# Altium project AtlysAFE.PrjPCB (part 2 of 2)
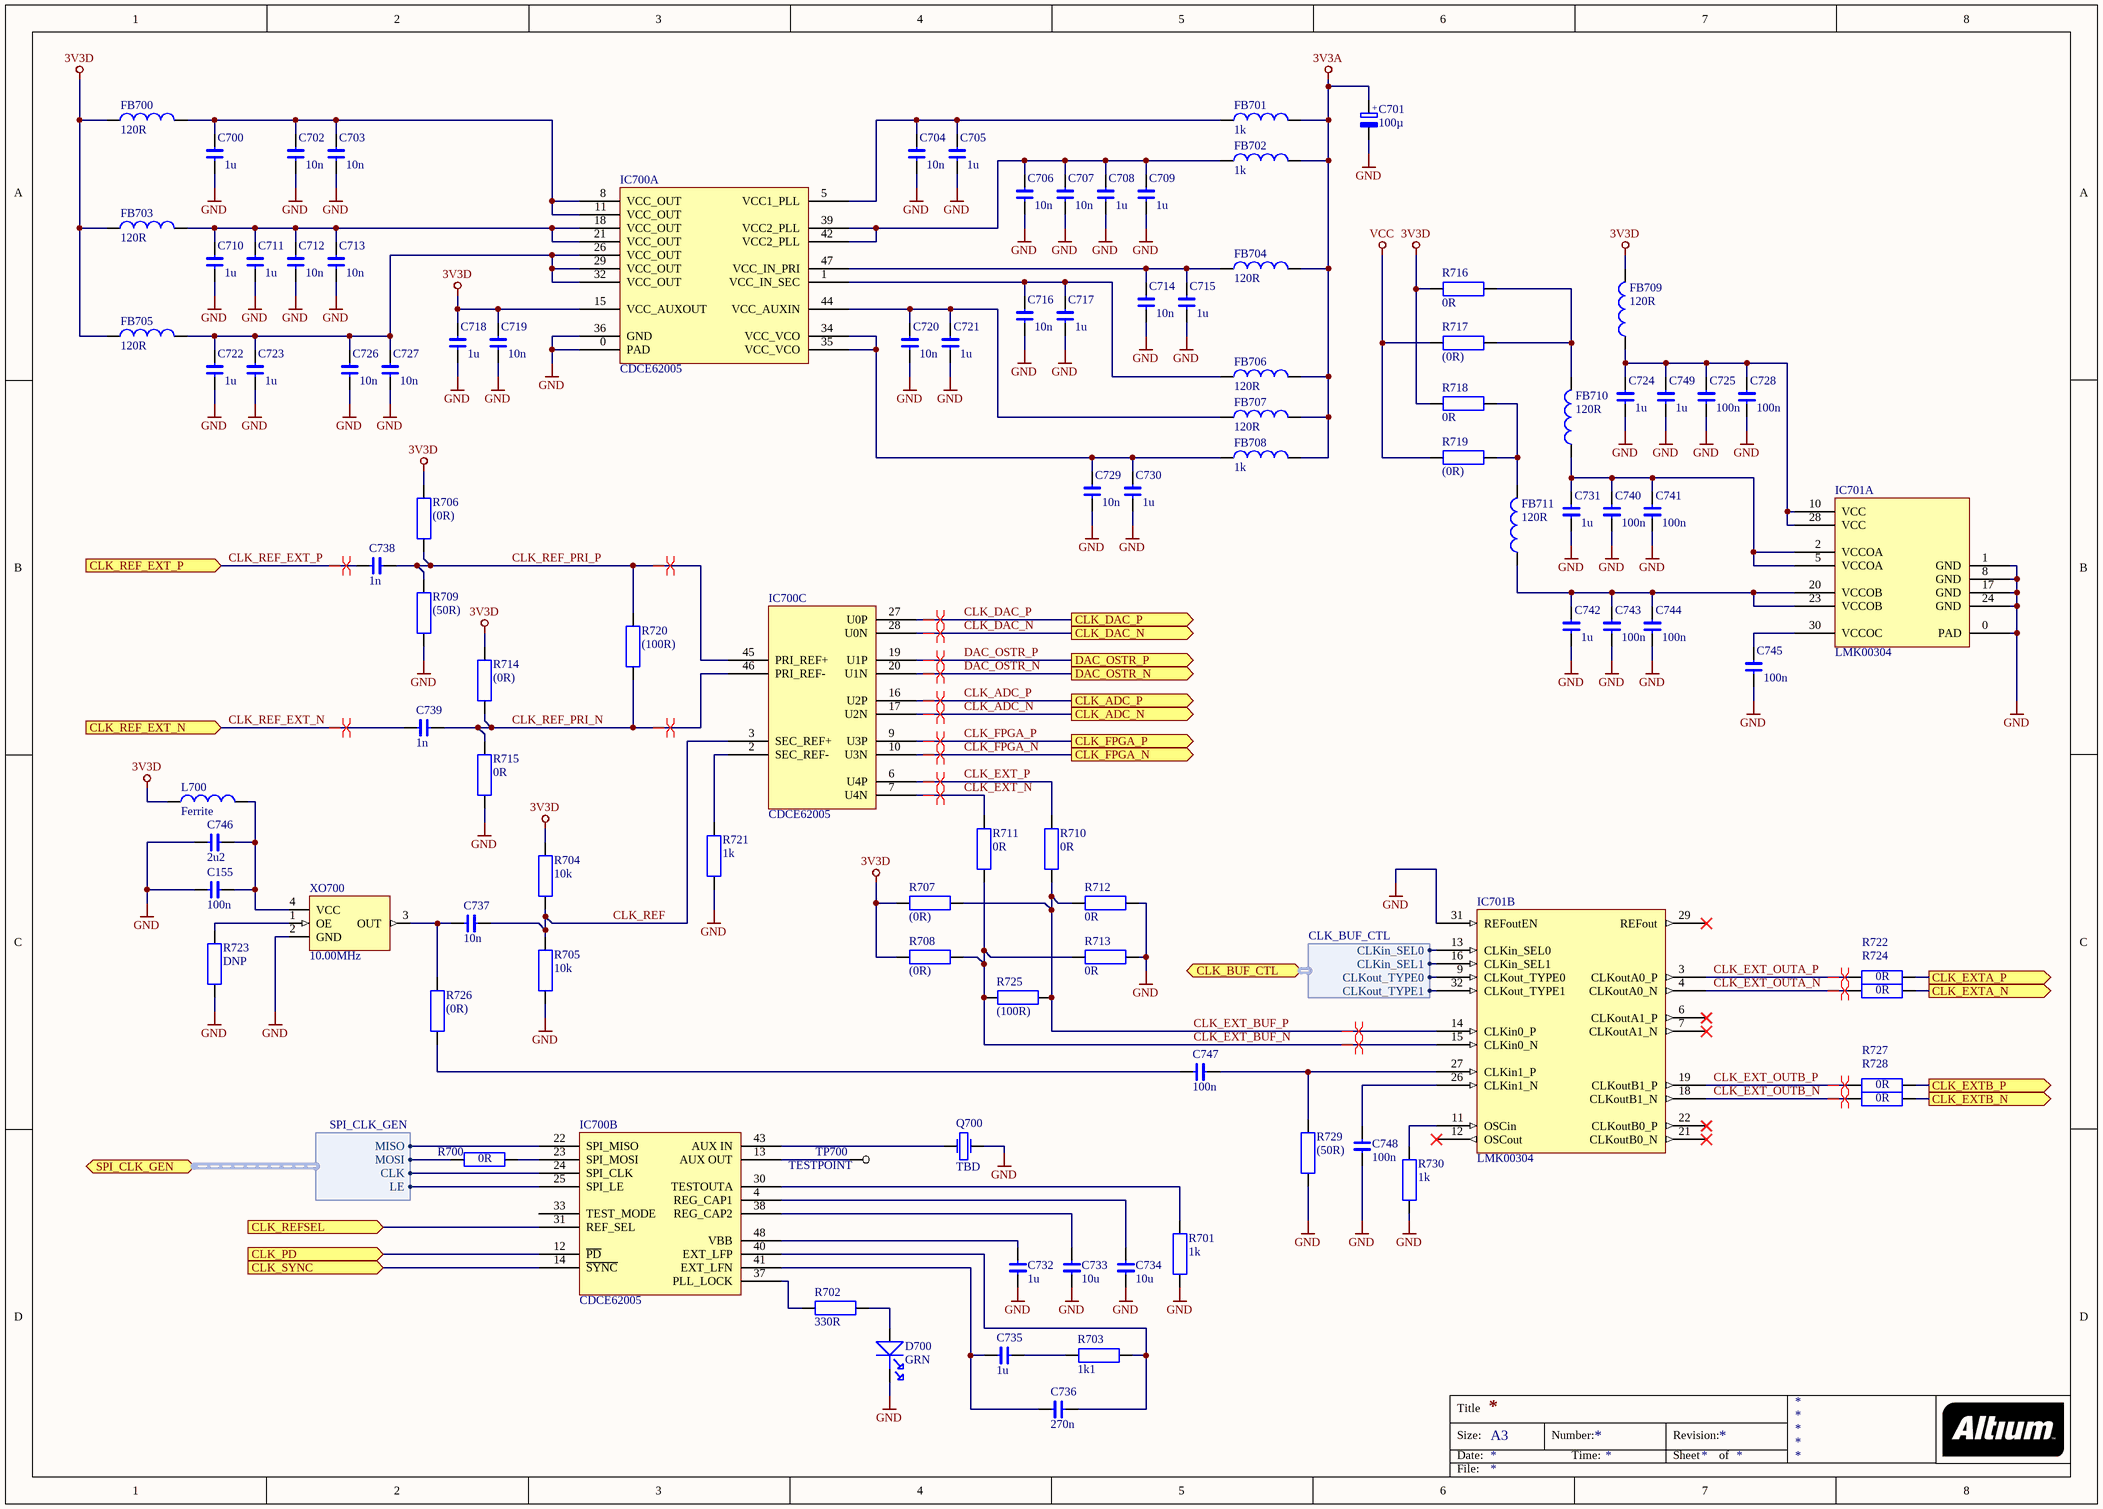
[diagram p8: Clock.SchDoc]

## Nets that join several sheets
1V8D: DAC (10 pins), FPGA (C410.1 IC400.11), Power (C519.1 L507.2), USB (7 pins)
3V3A: ADC (6 pins), ADC_Input (16 pins), DAC (9 pins), Power (5 pins), Clock (7 pins)
3V3D: Main (P3.15), ADC (15 pins), FPGA (16 pins), Power (C510.1 L503.2), USB (20 pins), Clock (15 pins)
DAC_BIAS: DAC (8 pins), Power (5 pins)
EXT_SUPPLY: Main (C4.1 P4.2), Power (13 pins)
GND: Main (44 pins), ADC (34 pins), ADC_Input (28 pins), DAC (27 pins), FPGA (23 pins), Power (47 pins), USB (30 pins), Clock (66 pins)
VCC: Main (5 pins), FPGA (C402.1 C403.1 IC400.80 IC400.93), Clock (R717.2 R719.2)
CLK_ADC_N: ADC (C119.1 R123.2 R125.1), Clock (IC700.17)
CLK_ADC_P: ADC (C118.1 R122.2 R124.1), Clock (IC700.16)
CLK_DAC_N: DAC (C312.1 R305.1), Clock (IC700.28)
CLK_DAC_P: DAC (C311.1 R304.1), Clock (IC700.27)
CLK_EXTA_N: Main (X8.2), Clock (R724.2)
CLK_EXTA_P: Main (X5.2), Clock (R722.2)
CLK_EXTB_N: Main (X14.2), Clock (R728.2)
CLK_EXTB_P: Main (X13.2), Clock (R727.2)
CLK_FPGA_N: FPGA (IC400.85), Clock (IC700.10)
CLK_FPGA_P: FPGA (IC400.86), Clock (IC700.9)
CLK_REF_EXT_N: Main (X6.2), Clock (C739.1)
CLK_REF_EXT_P: Main (X3.2), Clock (C738.1)
DAC_OSTR_N: DAC (C314.1 R308.1), Clock (IC700.20)
DAC_OSTR_P: DAC (C313.1 R307.1), Clock (IC700.19)
DACA_BIAS_N: Main (X10.2), DAC (R314.2 R315.1)
DACA_BIAS_P: Main (X9.2), DAC (R311.2 R312.1)
DACB_BIAS_N: Main (X12.2), DAC (R320.2 R321.1)
DACB_BIAS_P: Main (X11.2), DAC (R317.2 R318.1)
FPGA_PGOOD: FPGA (IC400.74), Power (IC501.12 IC501.29 R504.2 R505.1)
IO1_N: Main (P1.35), ADC (IC100.38)
IO1_P: Main (P1.1), ADC (IC100.37)
IO2_N: Main (P1.37), ADC (IC100.40)
IO2_P: Main (P1.3), ADC (IC100.39)
IO3_N: Main (P1.38), ADC (IC100.42)
IO3_P: Main (P1.4), ADC (IC100.41)
IO4_N: Main (P1.40), FPGA (IC400.87)
IO4_P: Main (P1.6), FPGA (IC400.88)
IO5_N: Main (P1.41), ADC (IC100.46)
IO5_P: Main (P1.7), ADC (IC100.45)
IO6_N: Main (P1.43), ADC (IC100.48)
IO6_P: Main (P1.9), ADC (IC100.47)
IO7_N: Main (P1.44), FPGA (IC400.35 R400.1)
IO7_P: Main (P1.10), FPGA (IC400.34 R400.2)
IO8_N: Main (P1.46), FPGA (IC400.37 R401.1 R408.2)
IO8_P: Main (P1.12), FPGA (IC400.36 R401.2 R407.2)
IO9_N: Main (P1.47), FPGA (IC400.39 R402.1)
IO9_P: Main (P1.13), FPGA (IC400.38 R402.2)
IO10_N: Main (P1.49), ADC (IC100.44)
IO10_P: Main (P1.15), ADC (IC100.43)
IO11_N: Main (P1.54), DAC (IC300.10)
IO11_P: Main (P1.20), DAC (IC300.9)
IO12_N: Main (P1.56), DAC (IC300.12)
IO12_P: Main (P1.22), DAC (IC300.11)
IO13_N: Main (P1.57), DAC (IC300.14)
IO13_P: Main (P1.23), DAC (IC300.13)
IO14_N: Main (P1.59), DAC (IC300.16)
IO14_P: Main (P1.25), DAC (IC300.15)
IO15_N: Main (P1.60), DAC (IC300.18)
IO15_P: Main (P1.26), DAC (IC300.17)
IO16_N: Main (P1.62), DAC (IC300.20)
IO16_P: Main (P1.28), DAC (IC300.19)
IO17_N: Main (P1.63), DAC (IC300.22)
IO17_P: Main (P1.29), DAC (IC300.21)
IO18_N: Main (P1.65), DAC (IC300.24)
IO18_P: Main (P1.31), DAC (IC300.23)
IO19_N: Main (P1.66), DAC (IC300.26)
IO19_P: Main (P1.32), DAC (IC300.25)
IO20_N: Main (P1.68), DAC (IC300.28)
IO20_P: Main (P1.34), DAC (IC300.27)
JTAG_TCK: FPGA (IC400.91), USB (R600.2)
JTAG_TDI: FPGA (IC400.94), USB (R601.2)
JTAG_TDO: FPGA (IC400.95), USB (R602.2)
JTAG_TMS: FPGA (IC400.90), USB (R603.2)
NetC106_1: ADC (9 pins), ADC_Input (R201.1 R216.1)
NetIC100_4: ADC (IC100.4), FPGA (IC400.25)
NetIC100_30: ADC (IC100.30 R109.2), FPGA (IC400.24)
NetIC100_31: ADC (IC100.31 R108.2), FPGA (IC400.21)
NetIC100_32: ADC (IC100.32), FPGA (IC400.18)
NetIC100_34: ADC (IC100.34), FPGA (IC400.20)
NetIC200_3: ADC (R110.2), ADC_Input (IC200.3 R214.1)
NetIC200_10: ADC (R111.2), ADC_Input (IC200.10 R200.1)
NetIC200_12: ADC_Input (IC200.12 R212.2), FPGA (IC400.27)
NetIC201_3: ADC (R118.2), ADC_Input (IC201.3 R229.1)
NetIC201_10: ADC (R120.2), ADC_Input (IC201.10 R215.1)
NetIC201_12: ADC_Input (IC201.12 R227.2), FPGA (IC400.28)
NetIC300_30: DAC (IC300.30 R309.1), FPGA (IC400.14)
NetIC300_32: DAC (IC300.32), FPGA (IC400.12)
NetIC300_33: DAC (IC300.33), FPGA (IC400.16)
NetIC400_1: FPGA (IC400.1), USB (IC600.45)
NetIC400_2: FPGA (IC400.2), USB (IC600.44)
NetIC400_3: FPGA (IC400.3), USB (IC600.43)
NetIC400_4: FPGA (IC400.4), USB (IC600.41)
NetIC400_7: FPGA (IC400.7), USB (IC600.40)
NetIC400_8: FPGA (IC400.8), USB (IC600.39)
NetIC400_9: FPGA (IC400.9), USB (IC600.38)
NetIC400_13: DAC (R300.2), FPGA (IC400.13)
NetIC400_17: DAC (R301.1), FPGA (IC400.17)
NetIC400_19: ADC (R107.1), FPGA (IC400.19)
NetIC400_29: FPGA (IC400.29), Clock (IC700.14)
NetIC400_30: FPGA (IC400.30), Clock (IC700.31)
NetIC400_31: FPGA (IC400.31), Clock (IC700.12)
NetIC400_45: FPGA (IC400.45), Clock (IC700.22)
NetIC400_47: FPGA (IC400.47), Clock (R700.1)
NetIC400_48: FPGA (IC400.48), Clock (IC700.24)
NetIC400_49: FPGA (IC400.49), Clock (IC700.25)
NetIC400_51: Main (P3.14), FPGA (IC400.51)
NetIC400_52: Main (P3.13), FPGA (IC400.52)
NetIC400_53: Main (P3.12), FPGA (IC400.53)
NetIC400_54: Main (P3.11), FPGA (IC400.54)
NetIC400_57: Main (P3.10), FPGA (IC400.57)
NetIC400_58: Main (P3.9), FPGA (IC400.58)
NetIC400_59: Main (P3.8), FPGA (IC400.59)
NetIC400_60: Main (P3.7), FPGA (IC400.60)
NetIC400_61: FPGA (IC400.61), Clock (IC701.32)
NetIC400_62: Main (P3.6), FPGA (IC400.62)
NetIC400_63: Main (P3.5), FPGA (IC400.63)
NetIC400_64: Main (P3.4), FPGA (IC400.64)
NetIC400_65: Main (P3.3), FPGA (IC400.65)
NetIC400_66: Main (P3.2), FPGA (IC400.66)
NetIC400_67: Main (P3.1), FPGA (IC400.67)
NetIC400_68: FPGA (IC400.68), Clock (IC701.9)
NetIC400_69: FPGA (IC400.69), Clock (IC701.16)
NetIC400_70: FPGA (IC400.70), Clock (IC701.13)
NetIC400_71: FPGA (IC400.71), Power (IC502.13)
NetIC400_75: FPGA (IC400.75), Power (IC500.13)
NetR203_1: Main (X1.2), ADC_Input (R203.1)
NetR207_1: Main (X2.2), ADC_Input (R207.1)
NetR218_1: Main (X7.2), ADC_Input (R218.1)
NetR222_1: Main (X4.2), ADC_Input (R222.1)
USB_D_N: Main (P2.2), USB (IC600.7)
USB_D_P: Main (P2.3), USB (IC600.8)
USB_VBUS: Main (P2.1), USB (R607.1)